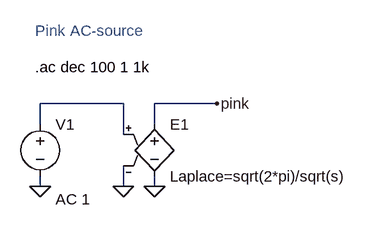
[diagram p0: schematic pink_ac_source.asc]
pink_ac_source.asc, the LTspice schematic file:
Version 4
SHEET 1 880 680
WIRE 256 128 128 128
WIRE 400 128 304 128
WIRE 128 160 128 128
WIRE 304 160 304 128
WIRE 256 176 256 128
WIRE 128 256 128 240
WIRE 256 256 256 224
WIRE 304 256 304 240
FLAG 128 256 0
FLAG 304 256 0
FLAG 256 256 0
FLAG 400 128 pink
SYMBOL voltage 128 144 R0
WINDOW 123 24 132 Left 0
WINDOW 39 0 0 Left 0
SYMATTR InstName V1
SYMATTR Value ""
SYMATTR Value2 AC 1
SYMBOL e 304 144 R0
SYMATTR InstName E1
SYMATTR Value Laplace=sqrt(2*pi)/sqrt(s)
TEXT 120 72 Left 0 !.ac dec 100 1 1k
TEXT 120 16 Left 0 ;Pink AC-source

The netlist it stands for:
* pink_ac_source.asc
V1 N001 0 AC 1
E1 pink 0 N001 0 Laplace=sqrt(2*pi)/sqrt(s)
.ac dec 100 1 1k
* Pink AC-source
.backanno
.end